# EAGLE design BiodataFeatherProMicro_004 (EAGLE 7.5.0)
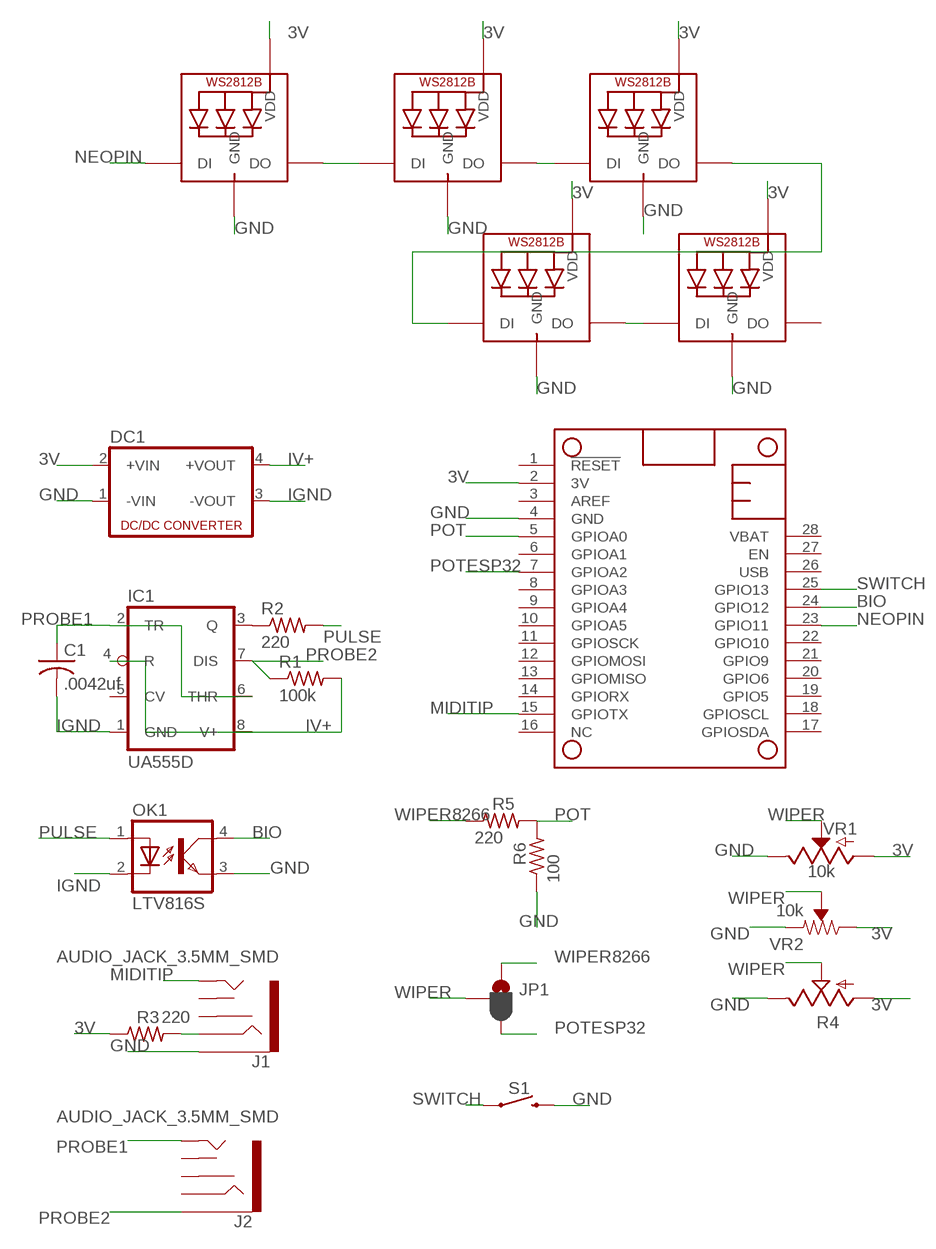
[diagram p0: schematic, sheet 1]

## Parts
C1  .0042uf  C-USC1206  [C1206]
DC1  NME  [NME]
IC1  UA555D  [SO08]
J1  AUDIO_JACK_3.5MM_SMD  [AUDIO-JACK-3.5MM-SMD]
J2  AUDIO_JACK_3.5MM_SMD  [AUDIO-JACK-3.5MM-SMD]
JP1  JUMPER-SMT_3_1-NC_PASTE_SILK  [SMT-JUMPER_3_1-NC_PASTE_SILK]
LED1  WS2812B5050  [WS2812B]
LED2  WS2812B5050  [WS2812B]
LED3  WS2812B5050  [WS2812B]
LED4  WS2812B5050  [WS2812B]
LED5  WS2812B5050  [WS2812B]
MS1  FEATHERWING  [FEATHERWING_NOHOLES]
OK1  LTV816S  [SMD4]
R1  100k  R-US_M1206  [M1206]
R2  220  R-US_M1206  [M1206]
R3  220  R-US_M1206  [M1206]
R4  TRIM_US-S63P  [S63P]
R5  220  R-US_M1206  [M1206]
R6  100  R-US_M1206  [M1206]
S1  MOMENTARY-SWITCH-SPST-PTH-6.0MM  [TACTILE_SWITCH_PTH_6.0MM]
VR1  10k  POTENTIOMETER-PTH-9MM-1/20W-20%-KIT  [POT-PTH-ALPS-KIT]
VR2  10k  TRIMPOT-PTH-10MM-KNOB-1/2W-10%  [TRIMPOT-PTH-3386U]

## Nets
3V: DC1.2(+VIN) LED1.1-VDD(VDD) LED2.1-VDD(VDD) LED3.1-VDD(VDD) LED4.1-VDD(VDD) LED5.1-VDD(VDD) MS1.2(3V) R3.1 R4.A VR1.P$3(A) VR2.3(CW)
BIO: MS1.24(GPIO12) OK1.4(COL)
GND: DC1.1(-VIN) J1.SLEEVE LED1.3-GND(GND) LED2.3-GND(GND) LED3.3-GND(GND) LED4.3-GND(GND) LED5.3-GND(GND) MS1.4(GND) OK1.3(EMIT) R4.E R6.1 S1.3 VR1.P$1(E) VR2.1(CCW)
IGND: C1.2 DC1.3(-VOUT) IC1.1(GND) OK1.2(C)
IV+: DC1.4(+VOUT) IC1.4(R) IC1.8(V+) R1.2
MIDITIP: J1.TIP MS1.15(GPIOTX)
N$1: IC1.3(Q) R2.1
N$2: J1.RING R3.2
N$4: LED1.2-DOUT(DO) LED2.4-DIN(DI)
N$5: LED2.2-DOUT(DO) LED3.4-DIN(DI)
N$6: LED4.2-DOUT(DO) LED5.4-DIN(DI)
N$7: LED3.2-DOUT(DO) LED4.4-DIN(DI)
NEOPIN: LED1.4-DIN(DI) MS1.23(GPIO11)
POT: MS1.5(GPIOA0) R5.2 R6.2
POTESP32: JP1.3 MS1.7(GPIOA2)
PROBE1: C1.1 IC1.2(TR) IC1.6(THR) J2.TIP
PROBE2: IC1.7(DIS) J2.SLEEVE R1.1
PULSE: OK1.1(A) R2.2
SWITCH: MS1.25(GPIO13) S1.1
WIPER: JP1.2 R4.S VR1.P$2(S) VR2.2(WIPER)
WIPER8266: JP1.1 R5.1
Unconnected: IC1.5(CV) J1.RSH J1.TSH J2.RING J2.RSH J2.TSH LED5.2-DOUT(DO) MS1.1(!RESET) MS1.3(AREF) MS1.6(GPIOA1) MS1.8(GPIOA3) MS1.9(GPIOA4) MS1.10(GPIOA5) MS1.11(GPIOSCK) MS1.12(GPIOMOSI) MS1.13(GPIOMISO) MS1.14(GPIORX) MS1.16(NC) MS1.17(GPIOSDA) MS1.18(GPIOSCL) MS1.19(GPIO5) MS1.20(GPIO6) MS1.21(GPIO9) MS1.22(GPIO10) MS1.26(USB) MS1.27(EN) MS1.28(VBAT)

## Library data of the parts
C1 = adafruit:C-US: CAPACITOR, American symbol
DC1 = dc-dc-converter:NME: DC-DC CONVERTER; MF: C & D TECHNOLOGIES, INC; MPN: NME1205D; OC_FARNELL: 1021466; OC_NEWARK: 98B8198
IC1 = adafruit:*555: TIMER Changed DIP package to have round (not oval) pin pads http://www.ladyada.net/library/pcb/eaglelibrary.html
J1 J2 = SparkFun-Connectors:AUDIO_JACK_3.5MM: Audio Jack 3.5mm variants of PTH and SMT stereo audio jack with bypass switches. SparkFun Products: SparkFun SparkPunk Sound Kit <[https://www.sparkfun.com/products/11177]> - PTH MP3 Trigger <https://www.sparkfun.com/products/13720> -3.5mm SMD SparkFun PicoBoard <https://www.sparkfun.com/products/11888>- 2.5mm SMD; PROD_ID: CONN-10353
JP1 = SparkFun-Jumpers:JUMPER-SMT_3_1-NC_PASTE: Normally closed solder jumper (1 of 2 connections) This jumper has an aperture in the stencil to allow solder paste to bridge one of the two connections. One connection is normally closed (NC), while the other is normally open (NO). Wick off the solder to open the connection. Reapply solder to reclose the connection. Apply solder to the other side instead to change the current path.
LED1-LED5 = adafruit:WS2812B
MS1 = adafruit:FEATHERWING
OK1 = optocoupler:LTV816: OPTO COUPLER Source: LITEON, LTV816.pdf; OC_FARNELL: unknown; OC_NEWARK: unknown
R1-R3 R5 R6 = resistor:R-US_: RESISTOR, American symbol
R4 = pot_sam:TRIM_US-: POTENTIOMETER
S1 = SparkFun-Switches:MOMENTARY-SWITCH-SPST: Momentary Switch (Pushbutton) - SPST Normally-open (NO) SPST momentary switches (buttons, pushbuttons). Variants PTH-12MM - 12mm square, through-hole Momentary Pushbutton Switch - 12mm Square <https://www.sparkfun.com/products/9190> (COM-09190) PTH-6.0MM, PTH-6.0MM-KIT - 6.0mm square, through-hole Mini Pushbutton Switch <https://www.sparkfun.com/products/97> (COM-00097) KIT package intended for soldering kit's - only one side of pads' copper is exposed. PTH-RIGHT-ANGLE-KIT - Right-angle, through-hole Right Angle Tactile Button <https://www.sparkfun.com/products/10791> - Used on SparkFun BigTime Watch Kit <https://www.sparkfun.com/products/11734> SMD-12MM - 12mm square, surface-mount Tactile Button - SMD (12mm) <https://www.sparkfun.com/products/12993> (COM-12993) Used on SparkFun PicoBoard <https://www.sparkfun.com/products/11888> SMD-4.5MM - 4.5mm Square Trackball Switch Used on SparkFun Blackberry Trackballer Breakout <https://www.sparkfun.com/products/13169> SMD-4.6MMX2.8MM - 4.60mm x 2.80mm, surface mount Used on SparkFun SAMD21 Mini Breakout <https://www.sparkfun.com/products/13664> SMD-5.2MM, SMD-5.2-REDUNDANT - 5.2mm square, surface-mount Mini Pushbutton Switch - SMD <https://www.sparkfun.com/products/8720> (COM-08720) Used on Arduino Pro Mini <https://www.sparkfun.com/products/11114> REDUNDANT package connects both switch circuits together SMD-6.0X3.5MM - 6.0 x 3.5mm, surface mount Momentary Reset Switch SMD <https://www.sparkfun.com/products/8229> (COM-08229) SMD-6.2MM-TALL - 6.2mm square, surface mount Tactile Button - SMD (6mm) <https://www.sparkfun.com/products/12992> Used on SparkFun Digital Sandbox <https://www.sparkfun.com/products/12651> SMD-RIGHT-ANGLE - Right-angle, surface mount Used on SparkFun Block for Intel® Edison - Arduino <https://www.sparkfun.com/products/13036>; PROD_ID: SWCH-08441; SF_SKU: COM-00097
VR1 = SparkFun-Resistors:POTENTIOMETER: Potentiometer (Pot) Three-terminal potentiometers, with an adjustable wiper and two adjustable resistors. A pot can be used to create a configurable voltage divider, or as a variable resistor. Variants ALPS_POT and ALPS_POT_KIT - PTH, breadboard compatible, 9mm square pots Rotary Potentiometer - Linear (10k ohm) <https://www.sparkfun.com/products/9288> (COM-09288) The KIT variant exposes copper on only one side of the PTH pad, so the part can only be assembled on one side of the PCB. Useful for beginner soldering kits.; PROD_ID: RES-09177; SF_SKU: COM-09288
VR2 = SparkFun-Resistors:TRIMPOT: Trimming Potentiometer (Trimpot) Three-terminal potentiometers, with an adjustable wiper and two adjustable resistors. A pot can be used to create a configurable voltage divider, or as a variable resistor. "Trimpots" are a subset of potentiometers, usually intended for "set-and-forget" applications. They're often more delicate than standard potentiometers - rated for fewer turns. Variants PTH-KNOB - PTH Trimpot w/ finger-adjustable knob Trimpot 10K with Knob <https://www.sparkfun.com/products/9806> (COM-09806) Datasheet <http://www.sparkfun.com/datasheets/Components/General/TSR-3386.pdf> SMD-3MM-CLOSED-FRAME - SMD 3mm Square Closed-Frame Trimpot Used on e.g. EasyDriver - Stepper Motor Driver <https://www.sparkfun.com/products/12779> Datasheet <http://www.bitechnologies.com/pdfs/22.pdf> (22AR10KTR) SMD-5MM - SMD 5mm Square Closed-Frame Trimpot Used on e.g. IOIO-OTG - V2.2 <https://www.sparkfun.com/products/13613> Datasheet <http://www.vishay.com/docs/51008/ts53.pdf> (TS53YL502MR10) SMD-3MM-1/10W-25% - 3mm Square Open-Frame Trimpot Used on e.g. SparkFun Shapeoko <https://www.sparkfun.com/products/13899> Datasheet <http://www.bourns.com/docs/Product-Datasheets/TC33.pdf> (TC33X-2-103E); PROD_ID: RES-09730; SF_SKU: COM-09806

## Board
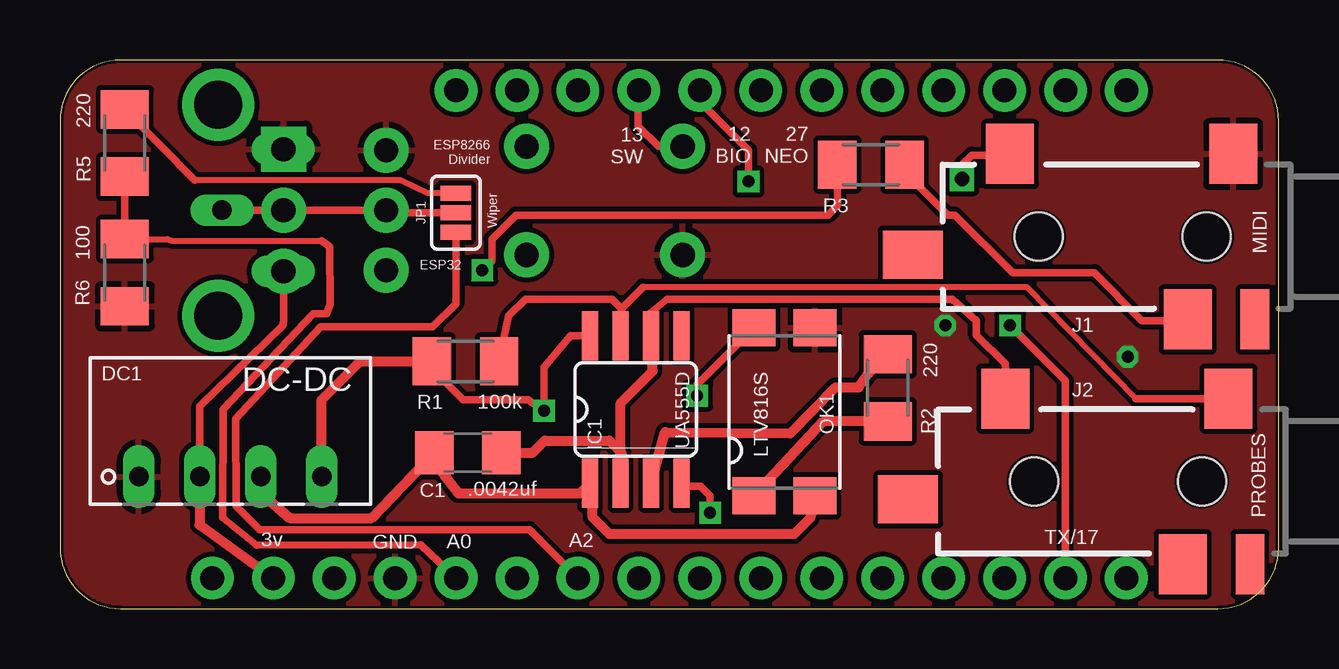
[diagram p1: board, top side]
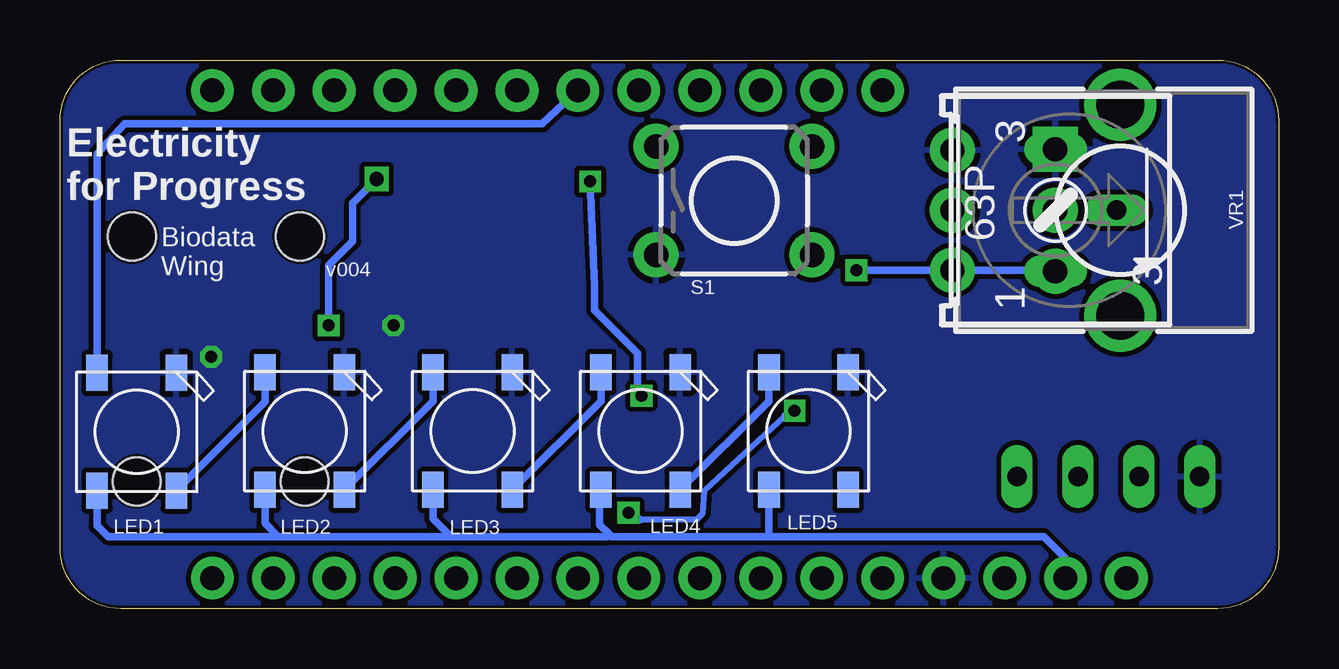
[diagram p2: board, bottom side, seen from below]

Size 50.8 x 22.86 mm. Coordinates in mm from the lower left corner, seen from the top.
Copper layers (1*16): Top 0.035mm / dielectric 1.5mm / Bottom 0.035mm
Design rules "default *": minimum track width 10mil, minimum drill 24mil, track to track 8mil, track to pad 8mil, pad to pad 8mil, via to via 8mil, smd to smd 8mil, copper to edge 5mil, drill to drill 8mil, minimum pad ring 10mil, minimum via ring 8mil, stop-mask expansion 4mil, vias tented up to drill 0mil, thermal gap 10mil

### Footprints (pad centres in the part's own frame; a part is rotated, then mirrored left to right if it is on the bottom)
C1206 = smd 1.6 x 1.8: 1 -1.4,0; 2 1.4,0
NME = drill 0.813 long: 1 0,3.81; 2 0,1.27; 3 0,-1.27; 4 0,-3.81
SO08 = smd 0.66 x 2.032: 1 -1.905,-3.073; 2 -0.635,-3.073; 3 0.635,-3.073; 4 1.905,-3.073; 5 1.905,3.073; 6 0.635,3.073; 7 -0.635,3.073; 8 -1.905,3.073
AUDIO-JACK-3.5MM-SMD = smd 2 x 2.5: RING 4.3,3.45; SLEEVE 2.4,-3.45; TIP 11.7,-3.45 | smd 1.2 x 2.5: RSH 1.5,3.45 | smd 2.5 x 2: TSH 15.75,0.75 | hole 2: 3.5,0; 10.5,0
SMT-JUMPER_3_1-NC_PASTE_SILK = smd 0.635 x 1.27: 1 -0.813,0; 2 0,0; 3 0.813,0
WS2812B = smd 1.5 x 0.9: 1-VDD 2.45,-1.65; 2-DOUT 2.45,1.65; 3-GND -2.45,1.65; 4-DIN -2.45,-1.65
FEATHERWING_NOHOLES = drill 1 pad 1.778: 1 6.35,1.27; 2 8.89,1.27; 3 11.43,1.27; 4 13.97,1.27; 5 16.51,1.27; 6 19.05,1.27; 7 21.59,1.27; 8 24.13,1.27; 9 26.67,1.27; 10 29.21,1.27; 11 31.75,1.27; 12 34.29,1.27; 13 36.83,1.27; 14 39.37,1.27; 15 41.91,1.27; 16 44.45,1.27; 17 44.45,21.59; 18 41.91,21.59; 19 39.37,21.59; 20 36.83,21.59; 21 34.29,21.59; 22 31.75,21.59; 23 29.21,21.59; 24 26.67,21.59; 25 24.13,21.59; 26 21.59,21.59; 27 19.05,21.59; 28 16.51,21.59
SMD4 = smd 1.78 x 1.55: 1 -1.27,-3.5; 2 1.27,-3.5; 3 1.27,3.5; 4 -1.27,3.5
M1206 = smd 1.6 x 2: 1 -1.4,0; 2 1.4,0
S63P = drill 0.813 long: A 2.54,0; E -2.54,0; S 0,2.54
TACTILE_SWITCH_PTH_6.0MM = drill 1.016 pad 1.88: 1 -3.251,2.261; 2 3.251,2.261; 3 -3.251,-2.261; 4 3.251,-2.261
POT-PTH-ALPS-KIT = drill 1 pad 1.88: P$1 7,-2.5; P$2 7,0; P$3 7,2.5 | drill 2: P$4 0,-4.4; P$5 0,4.4
TRIMPOT-PTH-3386U = drill 1.016 pad 1.88 square: 1 -2.54,-0.015 | drill 1.016 pad 1.88: 2 0,-0.015; 3 2.54,-0.015

### Placement (x,y rotation side)
C1  17,6.5 180 top
DC1  7.1,5.5 90 top
IC1  24,8.3 0 top
J1  51.3,15.5 180 top
J2  51.1,5.3 180 top
JP1  16.5,16.5 270 top
LED1  47.6,7.37 270 bottom
LED2  40.6,7.4 270 bottom
LED3  33.6,7.4 270 bottom
LED4  26.6,7.4 270 bottom
LED5  19.6,7.4 270 bottom
MS1  0,0 0 top
OK1  30.2,8.2 0 top
R1  16.9,10.3 180 top
R2  34.5,9.2 270 top
R3  33.8,18.5 0 top
R4  9.3,16.6 270 bottom
R5  2.7,19.4 270 top
R6  2.7,14 90 top
S1  22.7,17 0 bottom
VR1  6.6,16.6 180 bottom
VR2  9.3,16.6 270 bottom

### Tracks (layer width: path | path; a pad name or v marks a point on that pad's centre or on a via)
3V  (via drill 0.5)
  Top 0.305: DC1.2 5.83,8.43 9.3,11.8 9.31,12.09 VR2.3 | R3.1 32.4,16.8 32,16.4 19,16.4 18,15.4 18,14.5 v17.6,14.1
  Top 0.406: DC1.2 5.82,3.49 MS1.2
  Bottom 0.305: 21.2,3 9.8,3 8.89,2.09 MS1.2 | 21.2,3 27.8,3 27.9,3.1 | 27.9,3.1 28.3,3.5 28.3,4.9 LED4.1-VDD | LED3.1-VDD 35.25,3.75 34.5,3 | 34.5,3 28,3 27.9,3.1 | LED2.1-VDD 42.25,3.55 41.7,3 | 41.7,3 34.5,3 | LED1.1-VDD 49.25,3.45 48.8,3 41.7,3 | LED5.1-VDD 21.25,3.05 21.2,3 | v17.6,14.1 VR1.P$3 9.36,14.1 VR2.3 R4.A
BIO  (via drill 0.5)
  Top 0.305: MS1.24 26.67,21.13 28.7,19.1 v28.7,17.8 | v26.56,8.87 26.56,9.33 OK1.4
  Bottom 0.305: v28.7,17.8 28.51,13.43 28.51,12.44 26.72,10.65 26.72,9.03 v26.56,8.87
GND  (via drill 0.5)
  other vias: 36.9,11.8 44.5,10.5
  pour Top (rank 2): 0,-0.1 50.9,-0.1 50.9,1.6 50.9,22.8 0,22.8 0,0
  pour Bottom: 0,-0.1 50.7,-0.1 50.7,22.9 0,22.9
IGND
  Top 0.406: DC1.3 8.37,4.83 9.58,3.77 12.98,3.77 C1.2 15.6,6.1 16.6,4.8 21.67,4.8 IC1.1 22.2,5.12 22.2,3.8 22.9,3.1 30.6,3.1 31.27,3.77 OK1.2
IV+  (via drill 0.5)
  Top 0.305: R1.2 15.5,10 16.8,8.7 19.5,8.7 v20.18,8.25 20.18,10.05 21.27,11.37 IC1.8 | v27.1,4 27.1,4.7 26.7,5.1 26.03,5.1 IC1.4
  Top 0.406: DC1.4 10.91,8.71 12.5,10.3 R1.2
  Bottom 0.254: 20.58,8.03 23.96,4.91 24.02,3.95 24.26,3.71 26.59,3.71 26.6,3.7
  Bottom 0.305: v20.18,8.25 20.58,8.03 | 26.6,3.7 v27.1,4
MIDITIP  (via drill 0.5, 0.6)
  Top 0.305: MS1.15 41.91,9.49 v39.6,11.8 | v37.6,17.9 37.6,18.5 38,18.9 39.55,18.9 J1.TIP
  Bottom 0.305: v39.6,11.8 39.6,14.3 38.6,15.3 38.6,16.9 v37.6,17.9
N$1
  Top 0.406: IC1.3 25.23,7.36 30.44,7.3 32.33,9.22 33.29,9.22 33.7,9.8 R2.1
N$2
  Top 0.305: R3.2 35.2,18.2 37,16.4 37.3,16.4 39.72,14 43.12,14 45.1,12 46.95,12 J1.RING
N$4
  Bottom 0.305: LED2.4-DIN 42.25,8.62 LED1.2-DOUT
N$5
  Bottom 0.305: LED3.4-DIN 35.25,8.65 LED2.2-DOUT
N$6
  Bottom 0.305: LED5.4-DIN 21.25,8.65 LED4.2-DOUT
N$7
  Bottom 0.305: LED4.4-DIN 28.25,8.65 LED3.2-DOUT
NEOPIN
  Bottom 0.305: LED1.4-DIN 49.25,18.95 48.1,20.2 30.7,20.2 MS1.23
POT
  Top 0.254: R6.2 4.48,15.4 4.65,15.33 10.9,15.33
  Top 0.305: R5.2 R6.2 | MS1.5 15.03,2.66 8.19,2.64 6.78,3.79 6.81,8.3 10.56,12.29 11.12,12.29 11.25,12.68 11.23,15.08 11.22,15.1 10.9,15.33
POTESP32
  Top 0.305: JP1.3 16.5,12.71 15.54,11.74 10.86,11.74 7.33,7.92 7.35,4.27 8.33,3.29 19.57,3.29 MS1.7
PROBE1
  Top 0.305: J2.TIP 39.4,10.2 38.2,11.4 38.2,12 37.2,12.9 25.3,12.9 24.6,12.3 24.6,11.41 IC1.6
  Top 0.406: C1.1 19.7,6.5 20.2,7 22.9,7 23.4,6.5 23.4,5.26 IC1.2 23.36,8.56 24.7,9.9 24.7,11.31 IC1.6
PROBE2
  Top 0.254: 44.85,8.75 40.3,13.4 24.3,13.4
  Top 0.305: J2.SLEEVE 44.85,8.75 | 24.3,13.4 23.4,12.5 | 23.4,12.5 23.4,11.41 | R1.1 18.7,12.2 19.4,12.9 23,12.9 23.4,12.5
  Top 0.406: 23.4,11.41 IC1.7
PULSE
  Top 0.406: R2.2 31.83,7.8 OK1.1
SWITCH
  Top 0.305: S1.1 24.94,19.26 24.1,20.1 24.1,21.56 MS1.25
WIPER  (via drill 0.5)
  Top 0.305: R4.S v9.5,16.6 13.1,16.6 VR1.P$2 13.7,16.5 JP1.2
  Bottom 0.305: VR2.2 v9.5,16.6
WIPER8266
  Top 0.254: JP1.1 15.33,17.32 14.21,17.84 5.61,17.84
  Top 0.305: 5.61,17.84 R5.1

### Text on the board
tNames: ESP8266 / Divider | 13 / SW | 12 / BIO | 27 / NEO | Wiper | ESP32 | MIDI | PROBES | 3v | GND | A0 | A2 | TX/17
bNames: Electricity / for Progress | v004 | Biodata / Wing
tStop: 2020 | Electricity / for Progress | Biodata / Wing | v004
bStop: 2020